# Altium schematic sheet State_feedback.SchDoc
size A4
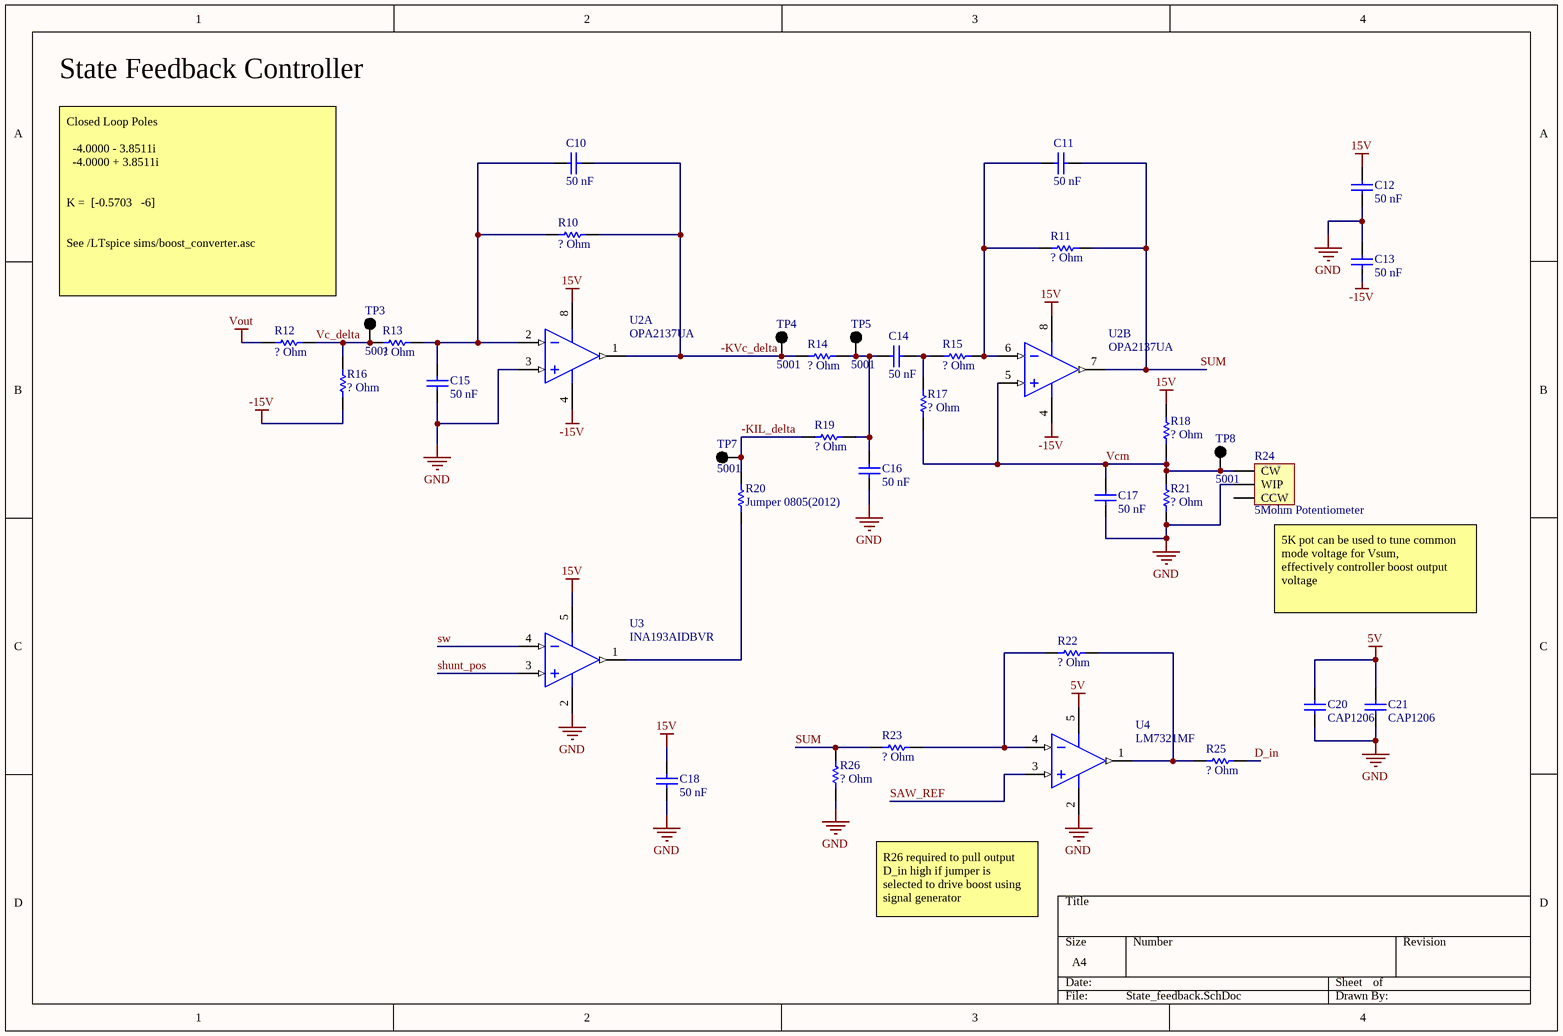
[diagram p0: State_feedback.SchDoc]

## Parts
C10  50 nF  [CAPC0805(2012)75_M]
C11  50 nF  [CAPC0805(2012)75_M]
C12  50 nF  [CAPC0805(2012)75_M]
C13  50 nF  [CAPC0805(2012)75_M]
C14  50 nF  [CAPC0805(2012)75_M]
C15  50 nF  [CAPC0805(2012)75_M]
C16  50 nF  [CAPC0805(2012)75_M]
C17  50 nF  [CAPC0805(2012)75_M]
C18  50 nF  [CAPC0805(2012)75_M]
C20  CAP1206  [CAPC1206(3216)150_L]
C21  CAP1206  [CAPC1206(3216)150_L]
R10  ? Ohm  [RESC0805(2012)_M]
R11  ? Ohm  [RESC0805(2012)_M]
R12  ? Ohm  [RESC0805(2012)_M]
R13  ? Ohm  [RESC0805(2012)_M]
R14  ? Ohm  [RESC0805(2012)_M]
R15  ? Ohm  [RESC0805(2012)_M]
R16  ? Ohm  [RESC0805(2012)_M]
R17  ? Ohm  [RESC0805(2012)_M]
R18  ? Ohm  [RESC0805(2012)_M]
R19  ? Ohm  [RESC0805(2012)_M]
R20  Jumper 0805(2012)  [RESC0805(2012)_N]
R21  ? Ohm  [RESC0805(2012)_M]
R22  ? Ohm  [RESC0805(2012)_M]
R23  ? Ohm  [RESC0805(2012)_M]
R24  5Mohm Potentiometer  [5k_pot]
R25  ? Ohm  [RESC0805(2012)_M]
R26  ? Ohm  [RESC0805(2012)_M]
TP3  5001  [KSTN-5001]
TP4  5001  [KSTN-5001]
TP5  5001  [KSTN-5001]
TP7  5001  [KSTN-5001]
TP8  5001  [KSTN-5001]
U2  OPA2137UA  [D0008A_M]  (parts A,B of 2)
U3  INA193AIDBVR  [DBV0005A_M]
U4  LM7321MF  [MF05A_L]

## Nets
5V: C20.2 C21.2 U4.5(V+)
15V: C12.1 C18.1 R18.2 U2.8(V+) U3.5(V+)
-15V: C13.2 R16.1 U2.4(V-)
GND: C12.2 C13.1 C15.2 C16.1 C17.1 C18.2 C20.1 C21.1 R21.1 R24.2(WIP) R26.1 U2.3(IN_A+) U3.2(GND) U4.2(V-)
Vout: R12.1
-KIL_delta: R19.1 R20.2 TP7.1
-KVc_delta: C10.2 R10.2 R14.1 TP4.1 U2.1(OUT_A)
D_in: R25.2
SAW_REF: U4.3(IN+)
shunt_pos: U3.3(VIN+)
SUM: C11.2 R11.2 R23.1 R26.2 U2.7(OUT_B)
sw: U3.4(VIN-)
Vc_delta: R12.2 R13.1 R16.2 TP3.1
Vcm: C17.2 R17.1 R18.1 R21.2 R24.1(CW) TP8.1 U2.5(IN_B+)
NetC10_1: C10.1 C15.1 R10.1 R13.2 U2.2(IN_A-)
NetC11_1: C11.1 R11.1 R15.2 U2.6(IN_B-)
NetC14_1: C14.1 C16.2 R14.2 R19.2 TP5.1
NetC14_2: C14.2 R15.1 R17.2
NetR20_1: R20.1 U3.1(OUT)
NetR22_1: R22.1 R23.2 U4.4(IN-)
NetR22_2: R22.2 R25.1 U4.1(OUT)

Not connected (* = marked no-connect by the designer): R24 3(CCW)

## Notes on the sheet
- State Feedback Controller
- Closed Loop Poles
  -4.0000 - 3.8511i
  -4.0000 + 3.8511i
  K =  [-0.5703   -6]
  See /LTspice sims/boost_converter.asc
- (near R24) 5K pot can be used to tune common mode voltage for Vsum,
  effectively controller boost output voltage
- R26 required to pull output D_in high if jumper is selected to drive boost using signal generator

## Library data of the parts
C10-C18 = CMP-1036-00018-1: CAP 0.5pF 50V ±0.1pF 0805 (2012 Metric) Thickness 0.75mm SMD; Case-EIA: 0805; Case-Metric: 2012; Tolerance: Â±0.1pF; Value: 0.5pF; Technology: SMT; Rated Voltage: 50 V; Max Thickness: 0.75 mm
C20 C21 = CMP-1590-00001-1: 1206 (3216 Metric) Chip Capacitor; Case-Metric: 3216; Case-EIA: 1206; PackageReference: CAPC1206(3216)150
R10-R19 R21-R23 R25 R26 = CMP-1013-00017-1: 4R3 0.125W 5% 0805 (2012 Metric)  SMD; Value: 4.30 Ohm; Case-Metric: 2012; Case-EIA: 0805; Tolerance: 5 %; Power: 0.125 W; Technology: SMT
R20 = CMP-1013-00001-1: Jumper 0805 (2012 Metric); Case-EIA: 0805; Value: 0.00 Ohm; Tolerance: None; Case-Metric: 2012; Technology: SMT; Power: None
R24 = 5Mohm Potentiometer: 3296W-1-505LF; Manufacturer PN: 3296W-1-505LF
TP3-TP5 TP7 TP8 = CMP-2000-05181-1: Test Point, Black, 1-Pin THD, RoHS, Bulk; Manufacturer: Keystone; Other Names: 5001K; Catalog Drawings: 5000Series; Kits: DKTGRS232C-KIT-ND / -TTLCONVERTER; Online Catalog: ColorCodedTestPoints; Datasheet URL: https://ciiva.com/datasheet-click-2917627?src=ciiva&sig=bd195616; Family: TestPoints; RoHS Information: RoHSComplianceStatement; Datasheet Version: Rev. G, 12/2008; Color: Black; Category: TestandMeasurement; Standard Package: 100; Manufacturer URL: http://www.keyelco.com/; Material: Base,Nylon46,UL94V-0; Type: PCTestPoint,Miniature; Series: THM; Packaging: Bulk
U2 = CMP-0017-00406-2: Low Cost FET-Input Operational Amplifier, 4.5 to 36 V, -40 to 85 degC, 8-pin SOIC (D8), Green (RoHS & no Sb/Br); Manufacturer: Texas Instruments; Iq per channel(Max)(mA): 0.27; CMRR(Min)(dB): 70; Sub Family: General Purpose Amplifier, High Supply Voltage Amplifier (>=30V), Low Power Amp (<=500uA); Number of Channels: 2; Offset Drift(Typ)(uV/C): 15; GBW(Typ)(MHz): 1; Rating: Catalog; Vio (25C)(Max)(mV): 3; Total Supply Voltage(Min)(+5V is 5, +/-5V is 10): 4.5; Vn at 1kHz(Typ)(nV/rtHz): 45; IIB(Max)(pA): 100; Total Supply Voltage(Max)(+5V is 5, +/-5V is 10): 36; Slew Rate(Typ)(V/us): 3.5; PackageVersion: 4040047-3/M, 06/2011; ComponentLink3Description: Package Specification; ComponentLink1URL: http://www.ti.com/; ComponentLink2Description: Datasheet; Eco-Plan: Green (RoHS & no Sb/Br); ComponentLink3URL: http://www.ti.com/litv/pdf/msoi002j; PackageReference: D0008A; ComponentLink1Description: Manufacturer URL; PackageDescription: 8-Pin Plastic Small Outline, Body 4.9 x 3.9 mm, Pitch 1.27 mm; ComponentLink2URL: http://www.ti.com/lit/ds/symlink/opa2137.pdf; Mounting Technology: Surface Mount; PartNumber: OPA2137UA; DatasheetVersion: SBOS089; Code_JEDEC: MS-012; PartId: 1
U3 = CMP-0704-00029-2: Voltage Output High-Side Measurement Current Shunt Monitor, 2.7 to 18 V, -40 to 125 degC, 5-pin SOT23 (DBV5), Green (RoHS & no Sb/Br); Manufacturer: Texas Instruments; Quiescent Current (+/-)(Typ)(mA): 0.7; CMRR(Min)(dB): 80; Input Offset (+/-)(Max)(uV): 2000; Vs(Min)(V): 2.7; Rating: Catalog; Vs(Max)(V): 18; Small-Signal Bandwidth(Typ)(MHz): 0.5; Gain(V/V): 20; Common Mode Range(Min)(V): -16; ComponentLink1URL: http://www.ti.com/; Eco-Plan: Green (RoHS & no Sb/Br); Code_JEDEC: MO-178; ComponentLink1Description: Manufacturer URL; ComponentLink2Description: Datasheet; DatasheetVersion: SBOS307F; PackageReference: DBV0005A; Output Type: Voltage; SubFamily: Current Shunt Monitor; ComponentLink3URL: http://www.ti.com/lit/ml/mpds018j/mpds018j.pdf; Mounting Technology: Surface Mount; ComponentLink3Description: Package Specification; ComponentLink2URL: http://www.ti.com/general/docs/lit/getliterature.tsp?genericPartNumber=INA193&fileType=pdf; PartNumber: INA193AIDBVR; PackageDescription: 5-Pin Plastic Small Outline, Body 1.6 x 2.9 mm, Pitch 0.95 mm; PackageVersion: 4073253-4/K, 03/2006; Common Mode Range(Max)(V): 80
U4 = CMP-0055-01343-2: Rail-to-Rail Input/Output, ±15V, High Output Current and Unlimited Capacitive Load Operational Amplifier, 5-pin SOT-23; Manufacturer: National Semiconductor; CompType: Amplifiers; PackageTopMarking: AU4A*XTT; PowerWise: Y; PackageVersion: revD, Aug-2008; DatasheetVersion: Sep-2008; ComponentLink2Description: LM7321 Web Page; PackageReference: MF05A; ComponentLink3Description: MF05A Package Page; ComponentLink3URL: http://www.national.com/packaging/folders/mf05a.html; ComponentLink2URL: http://www.national.com/pf/LM/LM7321.html; PinCount: 5; RevisionNote: Component URLs added; ComponentLink1URL: http://www.national.com/ds/LM/LM7321.pdf; ComponentLink1Description: LM7321 Datasheet; PackageDescription: Molded SOT-23, .115 x .063 x .040 in Body, 5 Lead, .0375 in Pitch; RoHS: Y